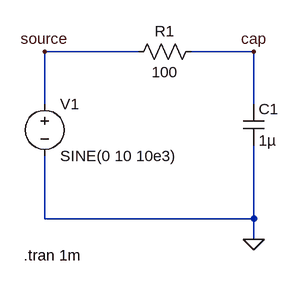
[diagram p0: schematic rc.asc]
rc.asc, the LTspice schematic file:
Version 4
SHEET 1 880 680
WIRE 144 32 0 32
WIRE 320 32 224 32
WIRE 0 112 0 32
WIRE 320 112 320 32
WIRE 0 288 0 192
WIRE 320 288 320 176
WIRE 320 288 0 288
WIRE 320 320 320 288
FLAG 320 320 0
FLAG 0 32 source
FLAG 320 32 cap
SYMBOL voltage 0 96 R0
WINDOW 123 0 0 Left 0
WINDOW 39 0 0 Left 0
SYMATTR InstName V1
SYMATTR Value SINE(0 10 10e3)
SYMBOL res 240 16 R90
WINDOW 0 0 56 VBottom 2
WINDOW 3 32 56 VTop 2
SYMATTR InstName R1
SYMATTR Value 100
SYMBOL cap 304 112 R0
SYMATTR InstName C1
SYMATTR Value 1µ
TEXT -32 344 Left 2 !.tran 1m

The netlist it stands for:
* rc.asc
V1 source 0 SINE(0 10 10e3)
R1 cap source 100
C1 cap 0 1µ
.tran 1m
.backanno
.end

* Results of the author's LTspice run, read from the files saved beside the schematic
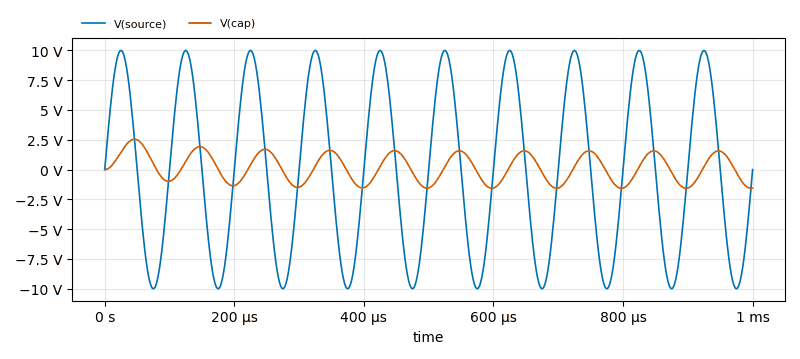
[diagram p1: Transient Analysis of rc.asc, plotted from the saved traces]
* Transient Analysis, 1 run:
*   V(source): min -10 V, max 10 V, average 6.239 µV, rms 7.071 V, last 0 V
*   V(cap): min -1.569 V, max 2.542 V, average 155.1 mV, rms 1.163 V, last -1.552 V